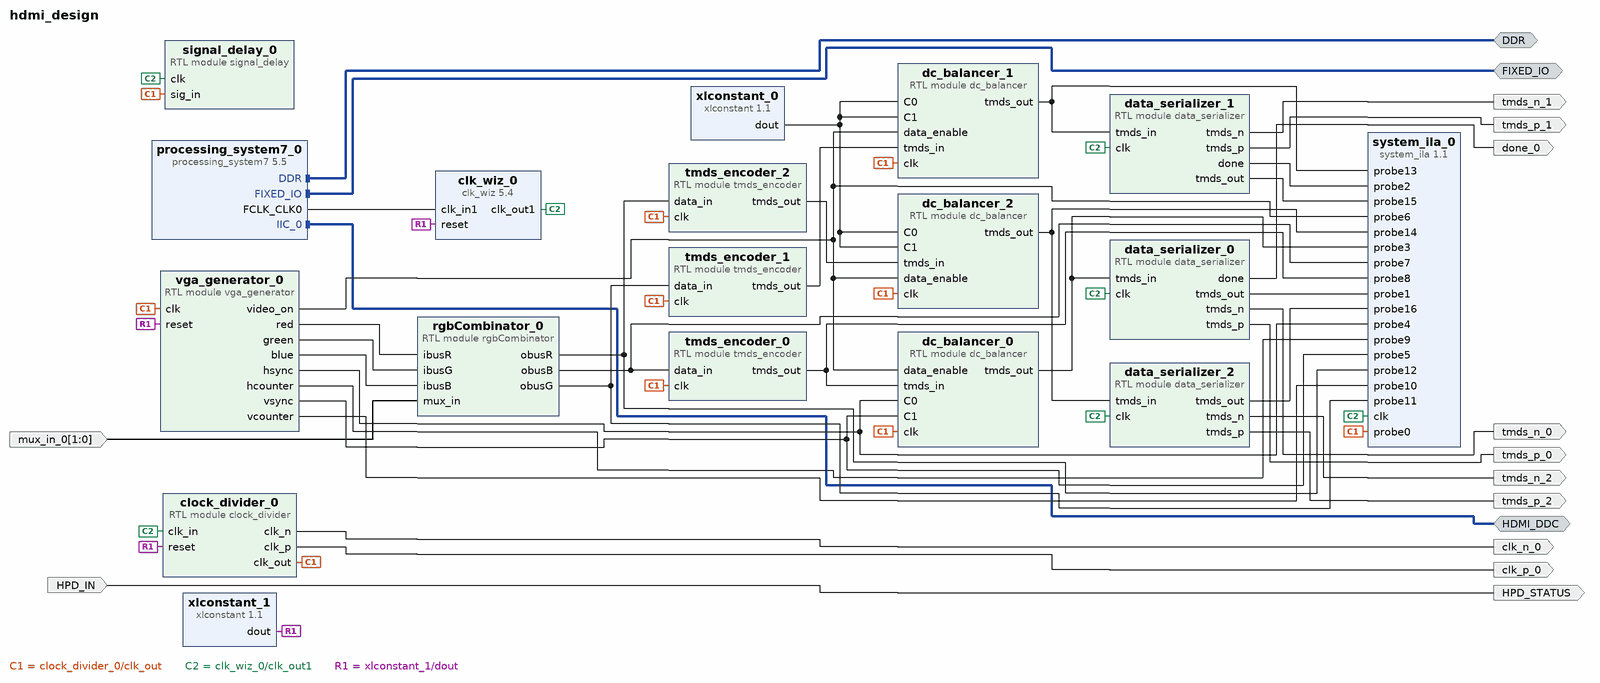
[diagram p0: block diagram of the top level]
# Vivado block design hdmi_design, xc7z010clg400-1, Vivado 2017.3
create_bd_design hdmi_design

create_bd_intf_port -mode Master -vlnv xilinx.com:interface:ddrx_rtl:1.0 DDR
create_bd_intf_port -mode Master -vlnv xilinx.com:display_processing_system7:fixedio_rtl:1.0 FIXED_IO
create_bd_intf_port -mode Master -vlnv xilinx.com:interface:iic_rtl:1.0 HDMI_DDC
create_bd_port -dir I -type data HPD_IN
create_bd_port -dir O -type data HPD_STATUS
create_bd_port -dir O -type clk clk_n_0
create_bd_port -dir O -type clk clk_p_0
create_bd_port -dir O done_0
create_bd_port -dir O tmds_n_0
create_bd_port -dir O tmds_p_0
create_bd_port -dir O tmds_n_1
create_bd_port -dir O tmds_p_1
create_bd_port -dir O tmds_n_2
create_bd_port -dir O tmds_p_2
create_bd_port -dir I -from 1 -to 0 mux_in_0

create_bd_cell -type ip -vlnv xilinx.com:ip:clk_wiz:5.4 clk_wiz_0
set_property -dict [list \
  CONFIG.PRIMITIVE MMCM \
  CONFIG.PRIM_IN_FREQ 250 \
  CONFIG.CLKIN1_JITTER_PS 40.0 \
  CONFIG.CLKOUT1_REQUESTED_OUT_FREQ 400 \
  CONFIG.CLKOUT1_DRIVES BUFG \
  CONFIG.CLKOUT2_DRIVES BUFG \
  CONFIG.CLKOUT3_DRIVES BUFG \
  CONFIG.CLKOUT4_DRIVES BUFG \
  CONFIG.CLKOUT5_DRIVES BUFG \
  CONFIG.CLKOUT6_DRIVES BUFG \
  CONFIG.CLKOUT7_DRIVES BUFG \
  CONFIG.FEEDBACK_SOURCE FDBK_AUTO \
  CONFIG.MMCM_DIVCLK_DIVIDE 1 \
  CONFIG.MMCM_CLKFBOUT_MULT_F 4.000 \
  CONFIG.MMCM_CLKIN1_PERIOD 4.000 \
  CONFIG.MMCM_CLKIN2_PERIOD 10.0 \
  CONFIG.MMCM_COMPENSATION ZHOLD \
  CONFIG.MMCM_CLKOUT0_DIVIDE_F 2.500 \
  CONFIG.CLKOUT1_JITTER 81.677 \
  CONFIG.CLKOUT1_PHASE_ERROR 85.928 \
] [get_bd_cells clk_wiz_0]
create_bd_cell -type module -reference clock_divider clock_divider_0
create_bd_cell -type module -reference data_serializer data_serializer_0
create_bd_cell -type module -reference data_serializer data_serializer_1
create_bd_cell -type module -reference data_serializer data_serializer_2
create_bd_cell -type module -reference dc_balancer dc_balancer_0
create_bd_cell -type module -reference dc_balancer dc_balancer_1
create_bd_cell -type module -reference dc_balancer dc_balancer_2
create_bd_cell -type ip -vlnv xilinx.com:ip:processing_system7:5.5 processing_system7_0
set_property -dict [list \
  CONFIG.PCW_UIPARAM_DDR_FREQ_MHZ 533.333333 \
  CONFIG.PCW_APU_PERIPHERAL_FREQMHZ 667 \
  CONFIG.PCW_SDIO_PERIPHERAL_FREQMHZ 50 \
  CONFIG.PCW_UART_PERIPHERAL_FREQMHZ 100 \
  CONFIG.PCW_I2C_PERIPHERAL_FREQMHZ 111.111115 \
  CONFIG.PCW_FPGA0_PERIPHERAL_FREQMHZ 250 \
  CONFIG.PCW_USE_M_AXI_GP0 0 \
  CONFIG.PCW_PRESET_BANK1_VOLTAGE {LVCMOS 1.8V} \
  CONFIG.PCW_UIPARAM_DDR_MEMORY_TYPE {DDR 3 (Low Voltage)} \
  CONFIG.PCW_UIPARAM_DDR_PARTNO {MT41K256M16 RE-125} \
  CONFIG.PCW_QSPI_PERIPHERAL_ENABLE 1 \
  CONFIG.PCW_QSPI_QSPI_IO {MIO 1 .. 6} \
  CONFIG.PCW_QSPI_GRP_SINGLE_SS_ENABLE 1 \
  CONFIG.PCW_QSPI_GRP_SINGLE_SS_IO {MIO 1 .. 6} \
  CONFIG.PCW_SINGLE_QSPI_DATA_MODE x4 \
  CONFIG.PCW_QSPI_GRP_FBCLK_ENABLE 1 \
  CONFIG.PCW_QSPI_GRP_FBCLK_IO {MIO 8} \
  CONFIG.PCW_ENET0_PERIPHERAL_ENABLE 1 \
  CONFIG.PCW_ENET0_ENET0_IO {MIO 16 .. 27} \
  CONFIG.PCW_ENET0_GRP_MDIO_ENABLE 1 \
  CONFIG.PCW_ENET0_GRP_MDIO_IO EMIO \
  CONFIG.PCW_ENET_RESET_ENABLE 1 \
  CONFIG.PCW_ENET_RESET_SELECT {Share reset pin} \
  CONFIG.PCW_ENET0_RESET_ENABLE 0 \
  CONFIG.PCW_SD0_PERIPHERAL_ENABLE 1 \
  CONFIG.PCW_SD0_SD0_IO {MIO 40 .. 45} \
  CONFIG.PCW_SD0_GRP_CD_ENABLE 1 \
  CONFIG.PCW_SD0_GRP_CD_IO {MIO 47} \
  CONFIG.PCW_SD0_GRP_WP_ENABLE 0 \
  CONFIG.PCW_UART1_PERIPHERAL_ENABLE 1 \
  CONFIG.PCW_UART1_UART1_IO {MIO 48 .. 49} \
  CONFIG.PCW_USB0_PERIPHERAL_ENABLE 1 \
  CONFIG.PCW_USB0_USB0_IO {MIO 28 .. 39} \
  CONFIG.PCW_USB_RESET_ENABLE 1 \
  CONFIG.PCW_USB_RESET_SELECT {Share reset pin} \
  CONFIG.PCW_USB0_RESET_ENABLE 1 \
  CONFIG.PCW_USB0_RESET_IO {MIO 46} \
  CONFIG.PCW_I2C0_PERIPHERAL_ENABLE 1 \
  CONFIG.PCW_I2C0_I2C0_IO EMIO \
  CONFIG.PCW_I2C_RESET_ENABLE 1 \
  CONFIG.PCW_I2C_RESET_SELECT {Share reset pin} \
  CONFIG.PCW_GPIO_MIO_GPIO_ENABLE 1 \
  CONFIG.PCW_GPIO_MIO_GPIO_IO MIO \
] [get_bd_cells processing_system7_0]
# 298 more settings of processing_system7_0 are not shown: defaults, MIO pin electricals, DDR timing, and values the tool derives
create_bd_cell -type module -reference signal_delay signal_delay_0
create_bd_cell -type ip -vlnv xilinx.com:ip:system_ila:1.1 system_ila_0
set_property -dict [list \
  CONFIG.C_PROBE16_TYPE 0 \
  CONFIG.C_PROBE15_TYPE 0 \
  CONFIG.C_PROBE14_TYPE 0 \
  CONFIG.C_PROBE13_TYPE 0 \
  CONFIG.C_PROBE12_TYPE 0 \
  CONFIG.C_PROBE11_TYPE 0 \
  CONFIG.C_PROBE10_TYPE 0 \
  CONFIG.C_PROBE9_TYPE 0 \
  CONFIG.C_PROBE8_TYPE 0 \
  CONFIG.C_PROBE7_TYPE 0 \
  CONFIG.C_PROBE6_TYPE 0 \
  CONFIG.C_PROBE5_TYPE 0 \
  CONFIG.C_PROBE4_TYPE 0 \
  CONFIG.C_PROBE3_TYPE 0 \
  CONFIG.C_DATA_DEPTH 8192 \
  CONFIG.C_NUM_OF_PROBES 18 \
  CONFIG.C_EN_STRG_QUAL 1 \
  CONFIG.C_ADV_TRIGGER true \
  CONFIG.C_PROBE17_MU_CNT 2 \
  CONFIG.C_PROBE16_MU_CNT 2 \
  CONFIG.C_PROBE15_MU_CNT 2 \
  CONFIG.C_PROBE14_MU_CNT 2 \
  CONFIG.C_PROBE13_MU_CNT 2 \
  CONFIG.C_PROBE12_MU_CNT 2 \
  CONFIG.C_PROBE11_MU_CNT 2 \
  CONFIG.C_PROBE10_MU_CNT 2 \
  CONFIG.C_PROBE9_MU_CNT 2 \
  CONFIG.C_PROBE8_MU_CNT 2 \
  CONFIG.C_PROBE7_MU_CNT 2 \
  CONFIG.C_PROBE6_MU_CNT 2 \
  CONFIG.C_PROBE5_MU_CNT 2 \
  CONFIG.C_PROBE4_MU_CNT 2 \
  CONFIG.C_PROBE3_MU_CNT 2 \
  CONFIG.C_PROBE2_MU_CNT 2 \
  CONFIG.C_PROBE1_MU_CNT 2 \
  CONFIG.C_PROBE0_MU_CNT 2 \
  CONFIG.ALL_PROBE_SAME_MU_CNT 2 \
  CONFIG.C_MON_TYPE NATIVE \
  CONFIG.C_PROBE_WIDTH_PROPAGATION AUTO \
] [get_bd_cells system_ila_0]
create_bd_cell -type module -reference tmds_encoder tmds_encoder_0
create_bd_cell -type module -reference tmds_encoder tmds_encoder_1
create_bd_cell -type module -reference tmds_encoder tmds_encoder_2
create_bd_cell -type ip -vlnv xilinx.com:ip:xlconstant:1.1 xlconstant_0
set_property -dict {CONFIG.CONST_VAL 0} [get_bd_cells xlconstant_0]
create_bd_cell -type ip -vlnv xilinx.com:ip:xlconstant:1.1 xlconstant_1
set_property -dict {CONFIG.CONST_VAL 0} [get_bd_cells xlconstant_1]
create_bd_cell -type module -reference vga_generator vga_generator_0
set_property -dict [list \
  CONFIG.H_ACTIVE_VIDEO 800 \
  CONFIG.H_BACK_PORCH 88 \
  CONFIG.H_FRONT_PORCH 40 \
  CONFIG.H_SYNC_PULSE 128 \
  CONFIG.V_ACTIVE_VIDEO 600 \
  CONFIG.V_BACK_PORCH 23 \
  CONFIG.V_FRONT_PORCH 1 \
  CONFIG.V_SYNC_PULSE 4 \
] [get_bd_cells vga_generator_0]
create_bd_cell -type module -reference rgbCombinator rgbCombinator_0

# ---- connections ----

connect_bd_intf_net [get_bd_intf_ports DDR] [get_bd_intf_pins processing_system7_0/DDR]
connect_bd_intf_net [get_bd_intf_ports FIXED_IO] [get_bd_intf_pins processing_system7_0/FIXED_IO]
connect_bd_intf_net [get_bd_intf_ports HDMI_DDC] [get_bd_intf_pins processing_system7_0/IIC_0]
connect_bd_net [get_bd_ports HPD_IN] [get_bd_ports HPD_STATUS]
connect_bd_net -net clk_wiz_0_clk_out1 [get_bd_pins clock_divider_0/clk_out] \
  [get_bd_pins dc_balancer_0/clk] [get_bd_pins dc_balancer_1/clk] [get_bd_pins dc_balancer_2/clk] \
  [get_bd_pins signal_delay_0/sig_in] [get_bd_pins system_ila_0/probe0] [get_bd_pins tmds_encoder_0/clk] \
  [get_bd_pins tmds_encoder_1/clk] [get_bd_pins tmds_encoder_2/clk] [get_bd_pins vga_generator_0/clk]
connect_bd_net [get_bd_pins clk_wiz_0/clk_out1] \
  [get_bd_pins clock_divider_0/clk_in] [get_bd_pins data_serializer_0/clk] [get_bd_pins data_serializer_1/clk] \
  [get_bd_pins data_serializer_2/clk] [get_bd_pins signal_delay_0/clk] [get_bd_pins system_ila_0/clk]
connect_bd_net [get_bd_pins clock_divider_0/clk_n] [get_bd_ports clk_n_0]
connect_bd_net [get_bd_pins clock_divider_0/clk_p] [get_bd_ports clk_p_0]
connect_bd_net [get_bd_pins data_serializer_0/done] [get_bd_ports done_0]
connect_bd_net [get_bd_pins data_serializer_0/tmds_n] [get_bd_ports tmds_n_0]
connect_bd_net [get_bd_pins data_serializer_0/tmds_out] [get_bd_pins system_ila_0/probe1]
connect_bd_net [get_bd_pins data_serializer_0/tmds_p] [get_bd_ports tmds_p_0]
connect_bd_net [get_bd_pins data_serializer_1/done] [get_bd_pins system_ila_0/probe2]
connect_bd_net [get_bd_pins data_serializer_1/tmds_n] [get_bd_ports tmds_n_1]
connect_bd_net [get_bd_pins data_serializer_1/tmds_p] [get_bd_ports tmds_p_1]
connect_bd_net [get_bd_pins data_serializer_2/tmds_n] [get_bd_ports tmds_n_2]
connect_bd_net [get_bd_pins data_serializer_2/tmds_p] [get_bd_ports tmds_p_2]
connect_bd_net [get_bd_pins dc_balancer_0/tmds_out] [get_bd_pins data_serializer_0/tmds_in] [get_bd_pins system_ila_0/probe3]
connect_bd_net [get_bd_pins dc_balancer_1/tmds_out] [get_bd_pins data_serializer_1/tmds_in] [get_bd_pins system_ila_0/probe13]
connect_bd_net [get_bd_pins dc_balancer_2/tmds_out] [get_bd_pins data_serializer_2/tmds_in] [get_bd_pins system_ila_0/probe14]
connect_bd_net -net hcounter [get_bd_pins vga_generator_0/hcounter] [get_bd_pins system_ila_0/probe9]
connect_bd_net [get_bd_pins processing_system7_0/FCLK_CLK0] [get_bd_pins clk_wiz_0/clk_in1]
connect_bd_net [get_bd_pins tmds_encoder_0/tmds_out] [get_bd_pins dc_balancer_0/tmds_in] [get_bd_pins system_ila_0/probe8]
connect_bd_net [get_bd_pins tmds_encoder_1/tmds_out] [get_bd_pins dc_balancer_1/tmds_in]
connect_bd_net [get_bd_pins tmds_encoder_2/tmds_out] [get_bd_pins dc_balancer_2/tmds_in]
connect_bd_net -net vcounter [get_bd_pins vga_generator_0/vcounter] [get_bd_pins system_ila_0/probe10]
connect_bd_net -net vga_generator_0_blue [get_bd_pins rgbCombinator_0/obusB] [get_bd_pins tmds_encoder_0/data_in] [get_bd_pins system_ila_0/probe7]
connect_bd_net [get_bd_pins vga_generator_0/hsync] [get_bd_pins dc_balancer_0/C0] [get_bd_pins system_ila_0/probe4]
connect_bd_net [get_bd_pins vga_generator_0/video_on] \
  [get_bd_pins dc_balancer_0/data_enable] [get_bd_pins dc_balancer_1/data_enable] [get_bd_pins dc_balancer_2/data_enable] \
  [get_bd_pins system_ila_0/probe6]
connect_bd_net [get_bd_pins vga_generator_0/vsync] [get_bd_pins dc_balancer_0/C1] [get_bd_pins system_ila_0/probe5]
connect_bd_net [get_bd_pins xlconstant_0/dout] \
  [get_bd_pins dc_balancer_1/C0] [get_bd_pins dc_balancer_1/C1] [get_bd_pins dc_balancer_2/C0] [get_bd_pins dc_balancer_2/C1]
connect_bd_net [get_bd_pins xlconstant_1/dout] [get_bd_pins clk_wiz_0/reset] [get_bd_pins clock_divider_0/reset] [get_bd_pins vga_generator_0/reset]
connect_bd_net -net Combinator_4x4_0_obus1 [get_bd_pins rgbCombinator_0/obusR] [get_bd_pins tmds_encoder_2/data_in] [get_bd_pins system_ila_0/probe12]
connect_bd_net -net Combinator_4x4_0_obus2 [get_bd_pins rgbCombinator_0/obusG] [get_bd_pins tmds_encoder_1/data_in] [get_bd_pins system_ila_0/probe11]
connect_bd_net [get_bd_pins data_serializer_1/tmds_out] [get_bd_pins system_ila_0/probe15]
connect_bd_net [get_bd_pins data_serializer_2/tmds_out] [get_bd_pins system_ila_0/probe16]
connect_bd_net [get_bd_pins vga_generator_0/red] [get_bd_pins rgbCombinator_0/ibusR]
connect_bd_net [get_bd_pins vga_generator_0/green] [get_bd_pins rgbCombinator_0/ibusG]
connect_bd_net [get_bd_pins vga_generator_0/blue] [get_bd_pins rgbCombinator_0/ibusB]
connect_bd_net -net mux_in_0_1 [get_bd_ports mux_in_0] [get_bd_pins rgbCombinator_0/mux_in]

validate_bd_design
save_bd_design
